# EAGLE design RFM2Pi_v2.6 (EAGLE 6.1)
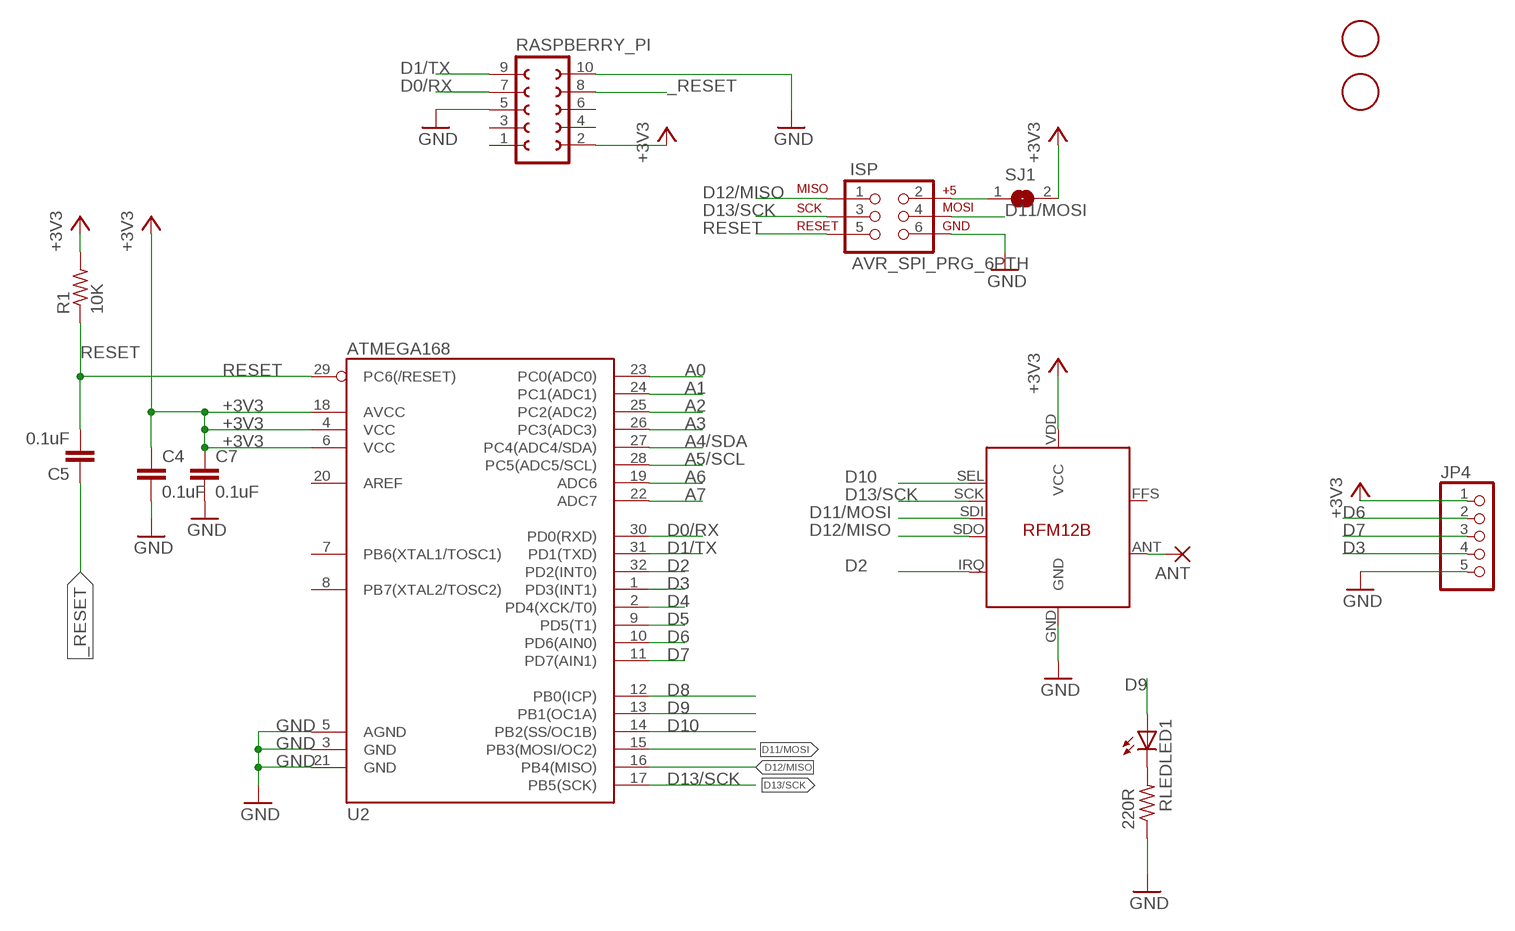
[diagram p0: schematic, sheet 1]

## Parts
ANT  1,6/0,8  [1,6/0,8]
C4  0.1uF  C-EUC0603  [C0603]
C5  0.1uF  C-EUC0603  [C0603]
C7  0.1uF  C-EUC0603  [C0603]
ISP  AVR_SPI_PRG_6PTH  [2X3]
JP4  PINHD-1X5  [1X05]
LED1  LEDSML0603  [SML0603]
R1  10K  R-US_R0603  [R0603]
RASPBERRY_PI  FE05-2  [FE05-2]
RFM12B  RFM12B  [RFM12B]
RLED  220R  R-US_R0603  [R0603]
SJ1  SJ  [SJ]
U2  ATMEGA168  [TQFP32-08]
U$1  FIDUCIAL  [FIDUCIAL_1MM]
U$2  FIDUCIAL  [FIDUCIAL_1MM]

## Nets
+3V3 [power]: C4.1 C7.1 JP4.1 R1.2 RASPBERRY_PI.2 RFM12B.VDD(VCC) SJ1.2 U2.4(VCC) U2.6(VCC) U2.18(AVCC)
+5V: ISP.2 SJ1.1
_RESET: C5.1 RASPBERRY_PI.8
A0: U2.23(PC0(ADC0))
A1: U2.24(PC1(ADC1))
A2: U2.25(PC2(ADC2))
A3: U2.26(PC3(ADC3))
A4/SDA: U2.27(PC4(ADC4/SDA))
A5/SCL: U2.28(PC5(ADC5/SCL))
A6: U2.19(ADC6)
A7: U2.22(ADC7)
D0/RX: RASPBERRY_PI.7 U2.30(PD0(RXD))
D1/TX: RASPBERRY_PI.9 U2.31(PD1(TXD))
D2: RFM12B.IRQ U2.32(PD2(INT0))
D3: JP4.4 U2.1(PD3(INT1))
D4: U2.2(PD4(XCK/T0))
D5: U2.9(PD5(T1))
D6: JP4.2 U2.10(PD6(AIN0))
D7: JP4.3 U2.11(PD7(AIN1))
D8: U2.12(PB0(ICP))
D9: LED1.A U2.13(PB1(OC1A))
D10: RFM12B.SEL U2.14(PB2(SS/OC1B))
D11/MOSI: ISP.4 RFM12B.SDI U2.15(PB3(MOSI/OC2))
D12/MISO: ISP.1 RFM12B.SDO U2.16(PB4(MISO))
D13/SCK: ISP.3 RFM12B.SCK U2.17(PB5(SCK))
GND [power]: C4.2 C7.2 ISP.6 JP4.5 RASPBERRY_PI.5 RASPBERRY_PI.10 RFM12B.GND RLED.1 U2.3(GND) U2.5(AGND) U2.21(GND)
N$3: LED1.C RLED.2
N$6 [power]: ANT.1(P) RFM12B.ANT
RESET: C5.2 ISP.5 R1.1 U2.29(PC6(/RESET))
Unconnected: RASPBERRY_PI.1 RASPBERRY_PI.3 RASPBERRY_PI.4 RASPBERRY_PI.6 RFM12B.FFS U2.7(PB6(XTAL1/TOSC1)) U2.8(PB7(XTAL2/TOSC2)) U2.20(AREF)

## Library data of the parts
ANT = JeeLabs:1,6/0,8: THROUGH-HOLE PAD
C4 C5 = rcl:C-EU: CAPACITOR, European symbol
C7 = resistor:C-EU: CAPACITOR, European symbol
ISP = SparkFun:AVR_SPI_PRG_6: AVR ISP 6 Pin This is the reduced ISP connector for AVR programming. Common on Arduino. This footprint will take up less PCB space and can be used with a 10-pin to 6-pin adapter such as SKU: BOB-08508
JP4 = pinhead:PINHD-1X5: PIN HEADER
LED1 = led:LED: LED OSRAM: - CHIPLED LG R971, LG N971, LY N971, LG Q971, LY Q971, LO R971, LY R971 LH N974, LH R974 LS Q976, LO Q976, LY Q976 LO Q996 - Hyper CHIPLED LW Q18S LB Q993, LB Q99A, LB R99A - SideLED LS A670, LO A670, LY A670, LG A670, LP A670 LB A673, LV A673, LT A673, LW A673 LH A674 LY A675 LS A676, LA A676, LO A676, LY A676, LW A676 LS A679, LY A679, LG A679 - Hyper Micro SIDELED® LS Y876, LA Y876, LO Y876, LY Y876 LT Y87S - SmartLED LW L88C, LW L88S LB L89C, LB L89S, LG L890 LS L89K, LO L89K, LY L89K LS L896, LA L896, LO L896, LY L896 - TOPLED LS T670, LO T670, LY T670, LG T670, LP T670 LSG T670, LSP T670, LSY T670, LOP T670, LYG T670 LG T671, LOG T671, LSG T671 LB T673, LV T673, LT T673, LW T673 LH T674 LS T676, LA T676, LO T676, LY T676, LB T676, LH T676, LSB T676, LW T676 LB T67C, LV T67C, LT T67C, LS T67K, LO T67K, LY T67K, LW E67C LS E67B, LA E67B, LO E67B, LY E67B, LB E67C, LV E67C, LT E67C LW T67C LS T679, LY T679, LG T679 LS T770, LO T770, LY T770, LG T770, LP T770 LB T773, LV T773, LT T773, LW T773 LH T774 LS E675, LA E675, LY E675, LS T675 LS T776, LA T776, LO T776, LY T776, LB T776 LHGB T686 LT T68C, LB T68C - Hyper Mini TOPLED® LB M676 - Mini TOPLED Santana® LG M470 LS M47K, LO M47K, LY M47K Source: http://www.osram.convergy.de LUXEON: - LUMILED® LXK2-PW12-R00, LXK2-PW12-S00, LXK2-PW14-U00, LXK2-PW14-V00 LXK2-PM12-R00, LXK2-PM12-S00, LXK2-PM14-U00 LXK2-PE12-Q00, LXK2-PE12-R00, LXK2-PE12-S00, LXK2-PE14-T00, LXK2-PE14-U00 LXK2-PB12-K00, LXK2-PB12-L00, LXK2-PB12-M00, LXK2-PB14-N00, LXK2-PB14-P00, LXK2-PB14-Q00 LXK2-PR12-L00, LXK2-PR12-M00, LXK2-PR14-Q00, LXK2-PR14-R00 LXK2-PD12-Q00, LXK2-PD12-R00, LXK2-PD12-S00 LXK2-PH12-R00, LXK2-PH12-S00 LXK2-PL12-P00, LXK2-PL12-Q00, LXK2-PL12-R00 Source: www.luxeon.com KINGBRIGHT: KA-3528ASYC Source: www.kingbright.com
R1 RLED = adafruit:R-US_: RESISTOR, American symbol
RASPBERRY_PI = con-lsta:FE05-2: FEMALE HEADER; OC_FARNELL: unknown; OC_NEWARK: unknown
RFM12B = JeeLabs:RFM12B
SJ1 = jumper:SJ: SMD solder JUMPER
U2 = SparkFun:ATMEGA168
U$1 U$2 = adafruit:FIDUCIAL: For use by pick and place machines to calibrate the vision/machine, 1mm By microbuilder.eu

## Net classes
0 default: width 0.203 mm, drill 0.203 mm, clearance 0.203 mm
1 power: width 0.254 mm, drill 0.254 mm, clearance 0.254 mm

## Board
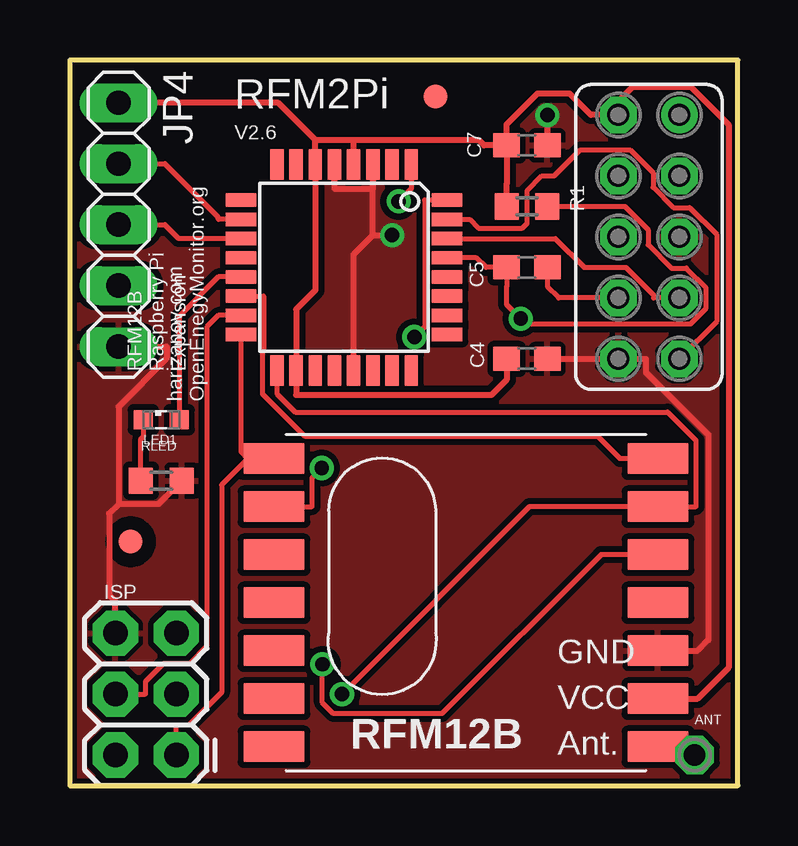
[diagram p1: board, top side]
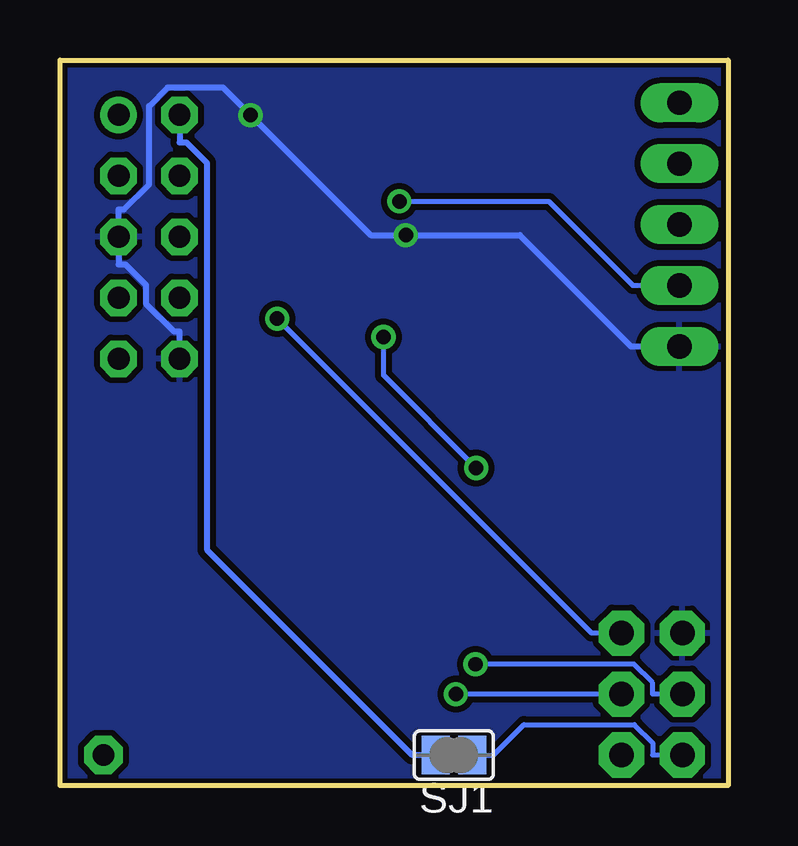
[diagram p2: board, bottom side, seen from below]

Size 27.84 x 30.23 mm. Coordinates in mm from the lower left corner, seen from the top.
Outline: 0,30.23 0,0 27.84,0 27.84,30.23 0,30.23
Copper layers (1*16): Top 0.035mm / dielectric 1.5mm / Bottom 0.035mm
Design rules: minimum track width 8mil, minimum drill 0.6mm, track to track 8mil, track to pad 8mil, pad to pad 8mil, via to via 8mil, smd to smd 8mil, copper to edge 8mil, drill to drill 8mil, minimum pad ring 12mil, minimum via ring 8mil, stop-mask expansion 4mil, vias tented up to drill 0mil, thermal gap 8mil

### Footprints (pad centres in the part's own frame; a part is rotated, then mirrored left to right if it is on the bottom)
1,6/0,8 = drill 0.9 pad 1.6 octagon: 1 0,0
C0603 = smd 1.1 x 1: 1 -0.85,0; 2 0.85,0
2X3 = drill 1.016 pad 1.88 octagon: 1 0,0; 2 0,2.54; 3 2.54,0; 4 2.54,2.54; 5 5.08,0; 6 5.08,2.54
1X05 = drill 1.016 long: 1 -5.08,0; 2 -2.54,0; 3 0,0; 4 2.54,0; 5 5.08,0
SML0603 = smd 0.8 x 0.8: A 0.75,0; C -0.75,0
R0603 = smd 1 x 1.1: 1 -0.85,0; 2 0.85,0
FE05-2 = drill 0.914: 1 -5.08,1.27 | drill 0.914 octagon: 2 -5.08,-1.27; 3 -2.54,1.27; 4 -2.54,-1.27; 5 0,1.27; 6 0,-1.27; 7 2.54,1.27; 8 2.54,-1.27; 9 5.08,1.27; 10 5.08,-1.27
RFM12B = smd 2.54 x 1.27: ANT 8,-6; FFS -8,2; GND 8,-2; IRQ -8,4; P$8 -8,0; P$9 -8,-2; P$10 -8,-4; P$12 -8,-6; P$16 8,0; SCK 8,4; SDI 8,2; SDO -8,6; SEL 8,6; VDD 8,-4
SJ = smd 1.168 x 1.6: 1 -0.762,0; 2 0.762,0
TQFP32-08 = smd 1.27 x 0.559: 1 -4.293,2.8; 2 -4.293,2; 3 -4.293,1.2; 4 -4.293,0.4; 5 -4.293,-0.4; 6 -4.293,-1.2; 7 -4.293,-2; 8 -4.293,-2.8; 17 4.293,-2.8; 18 4.293,-2; 19 4.293,-1.2; 20 4.293,-0.4; 21 4.293,0.4; 22 4.293,1.2; 23 4.293,2; 24 4.293,2.8 | smd 0.559 x 1.27: 9 -2.8,-4.293; 10 -2,-4.293; 11 -1.2,-4.293; 12 -0.4,-4.293; 13 0.4,-4.293; 14 1.2,-4.293; 15 2,-4.293; 16 2.8,-4.293; 25 2.8,4.293; 26 2,4.293; 27 1.2,4.293; 28 0.4,4.293; 29 -0.4,4.293; 30 -1.2,4.293; 31 -2,4.293; 32 -2.8,4.293
FIDUCIAL_1MM = smd 1 x 1: 1 0,0

### Placement (x,y rotation side)
ANT  26.04,1.27 0 top
C4  19.05,17.78 0 top
C5  19.05,21.59 180 top
C7  19.05,26.67 0 top
ISP  4.45,1.27 90 top
JP4  2.03,23.37 270 top
LED1  3.81,15.24 0 top
R1  19.05,24.13 180 top
RASPBERRY_PI  24.13,22.86 270 top
RFM12B  16.51,7.62 0 top
RLED  3.81,12.7 180 top
SJ1  11.43,1.27 180 bottom
U2  11.43,21.59 270 top
U$1  15.24,28.7 0 top
U$2  2.54,10.16 0 top

### Tracks (layer width: path | path; a pad name or v marks a point on that pad's centre or on a via)
+3V3
  Top 0.254: C4.1 18.2,16.9 17.58,16.28 9.43,16.28 U2.18 9.43,19.84 10.23,20.64 U2.6 10.23,26.87 10.23,26.9 | RFM12B.VDD 26.16,3.62 27.45,4.91 27.45,27.54 25.87,29.12 23.46,29.12 22.29,27.94 | 22.29,27.94 21.72,27.94 20.83,28.83 19.48,28.83 18.2,27.55 C7.1 | RASPBERRY_PI.2 22.29,27.94 | 10.23,26.9 8.68,28.45 JP4.1 | C7.1 17.27,26.67 17.04,26.9 11.83,26.9 | 11.83,26.9 11.83,26.87 U2.4 | 10.23,26.9 11.83,26.9 | C7.1 18.2,25.06 R1.2
  Bottom 0.254: SJ1.2 13.16,1.27 21.72,9.83 21.72,25.94 22.57,26.8 22.86,26.8 RASPBERRY_PI.2
+5V
  Bottom 0.203: ISP.2 3.15,1.27 3.15,1.79 3.9,2.54 8.51,2.54 9.78,1.27 SJ1.1
_RESET
  Top 0.203: C5.1 19.9,20.79 20.37,20.32 RASPBERRY_PI.8
D0/RX
  Top 0.203: RASPBERRY_PI.7 24.33,20.32 24.33,20.43 23.17,21.59 21.43,21.59 20.23,22.79 U2.30
D1/TX
  Top 0.203: U2.31 16.66,23.59 17.03,23.22 18.86,23.22 19.06,23.42 19.06,24.78 19.68,25.4 20.18,25.4 21.27,26.49 23.35,26.49 24.31,25.53 24.31,24.93 25.15,24.08 25.83,24.08 26.95,22.96 26.95,19.33 RASPBERRY_PI.9
D2  (via drill 0.6 pad 1.01)
  Top 0.203: U2.32 14.78,24.39 14.78,19.11 v14.36,18.69 | v10.5,13.23 10.09,12.81 10.09,11.62 RFM12B.IRQ
  Bottom 0.203: v10.5,13.23 14.36,17.09 v14.36,18.69
D3  (via drill 0.6 pad 1.01)
  Top 0.203: U2.1 14.23,24.87 v13.7,24.34
  Bottom 0.203: JP4.4 3.96,20.83 7.47,24.34 v13.7,24.34
D6
  Top 0.203: U2.10 6.2,23.59 6.2,23.67 3.96,25.91 JP4.2
D7
  Top 0.203: JP4.3 3.96,23.37 4.54,22.79 U2.11
D9
  Top 0.203: U2.13 6.2,21.19 4.56,19.55 LED1.A
D10
  Top 0.203: RFM12B.SEL 22.93,13.62 22,14.56 9.78,14.56 8.02,16.32 8.02,18.15 8.08,18.21 8.08,20.39 U2.14
D11/MOSI  (via drill 0.6 pad 1.01)
  Top 0.203: RFM12B.SDI 22.14,9.62 15.51,2.99 10.99,2.99 10.53,3.45 v10.53,5.05 | ISP.4 3.15,3.81 3.15,4.33 3.9,5.08 4.97,5.08 5.71,5.82 5.71,19.11 6.2,19.59 U2.15
  Bottom 0.203: v10.53,5.05 3.93,5.05 3.15,4.28 3.15,3.81 ISP.4
D12/MISO
  Top 0.203: 7.43,13.62 6.33,12.52 6.33,3.88 4.96,2.52 4.45,2.52 ISP.1 | 7.43,13.62 7.14,13.91 U2.16 | RFM12B.SDO 7.43,13.62
D13/SCK  (via drill 0.6 pad 1.01)
  Top 0.203: v11.35,3.81 19.16,11.62 RFM12B.SCK 25.3,11.62 26.09,11.62 26.09,14.39 24.91,15.56 9.4,15.56 8.63,16.33 U2.17
  Bottom 0.203: v11.35,3.81 5.69,3.81 ISP.3
GND  (via drill 0.6 pad 1.01)
  Top 0.254: 12.63,22.93 12.63,24.87 | U2.21 11.83,22.13 12.63,22.93 | 12.63,22.93 v13.43,22.93 | RFM12B.GND 26.16,5.62 26.61,6.06 26.61,14.62 24,17.22 24,17.78 RASPBERRY_PI.10 C4.2 | 12.63,24.87 11.03,24.87 U2.5 | v19.9,27.93 C7.2 | U2.3 12.63,24.87 | JP4.5 4.04,18.29 4.04,17.79 2.03,15.79 2.03,11.73 | 2.03,11.73 1.64,11.34 1.64,7.94 1.9,7.67 ISP.6 | RLED.1 3.69,11.73 2.03,11.73
  Bottom 0.254: JP4.5 4.04,18.29 8.68,22.93 v13.43,22.93 14.9,22.93 v19.9,27.93 21.05,29.09 23.36,29.09 24.13,28.31 24.13,25.04 25.16,24 25.4,24 RASPBERRY_PI.5 25.4,21.72 25.11,21.72 24.26,20.86 24.26,20.08 23.1,18.92 22.86,18.92 22.86,18.35 RASPBERRY_PI.10
  pour Bottom: -1.27,31.75 29.21,31.75 29.21,-1.27 -1.27,-1.27
  pour Top: -1.27,-1.27 29.21,-1.27 29.21,31.75 -1.27,31.75
N$3
  Top 0.203: LED1.C 3.06,14.54 2.96,14.44 RLED.2
N$6
  Top 0.254: ANT.1 24.85,1.27 24.85,1.28 RFM12B.ANT
RESET  (via drill 0.6 pad 1.01)
  Top 0.203: R1.1 23.13,24.13 24.09,23.16 24.09,22.53 25.06,21.56 25.7,21.56 26.49,20.76 26.49,19.86 25.86,19.22 19.02,19.22 v18.79,19.45 18.2,20.04 18.2,20.79 C5.2 17.34,21.59 16.95,21.99 U2.29
  Bottom 0.203: v18.79,19.45 5.69,6.35 ISP.5

### Text on the board
_tsilk: RFM2Pi | V2.6 | RFM12B / Raspberry Pi / Expansion | harizanov.com / OpenEnegyMonitor.org